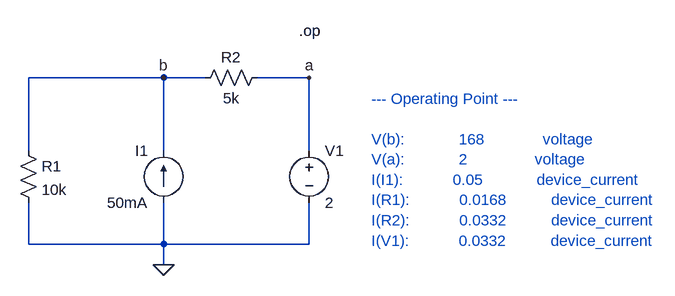
[diagram p0: schematic Draft6.asc]
Draft6.asc, the LTspice schematic file:
Version 4
SHEET 1 1068 680
WIRE 272 80 64 80
WIRE 336 80 272 80
WIRE 496 80 416 80
WIRE 64 192 64 80
WIRE 272 192 272 80
WIRE 496 192 496 80
WIRE 64 336 64 272
WIRE 272 336 272 272
WIRE 272 336 64 336
WIRE 496 336 496 272
WIRE 496 336 272 336
WIRE 272 368 272 336
FLAG 496 80 a
FLAG 272 80 b
FLAG 272 368 0
SYMBOL res 48 176 R0
SYMATTR InstName R1
SYMATTR Value 10k
SYMBOL res 320 96 R270
WINDOW 0 32 56 VTop 2
WINDOW 3 0 56 VBottom 2
SYMATTR InstName R2
SYMATTR Value 5k
SYMBOL current 272 272 R180
WINDOW 0 24 80 Left 2
WINDOW 3 24 0 Left 2
SYMATTR InstName I1
SYMATTR Value 50mA
SYMBOL voltage 496 176 R0
SYMATTR InstName V1
SYMATTR Value 2
TEXT 480 8 Left 2 !.op
TEXT 592 112 Left 2 ;--- Operating Point ---\n \nV(b):            168             voltage\nV(a):            2               voltage\nI(I1):           0.05            device_current\nI(R1):           0.0168          device_current\nI(R2):           0.0332          device_current\nI(V1):           0.0332          device_current

The netlist it stands for:
* Draft6.asc
R1 b 0 10k
R2 b a 5k
I1 0 b 50mA
V1 a 0 2
.op
* --- Operating Point ---
* V(b):            168             voltage
* V(a):            2               voltage
* I(I1):           0.05            device_current
* I(R1):           0.0168          device_current
* I(R2):           0.0332          device_current
* I(V1):           0.0332          device_current
.backanno
.end